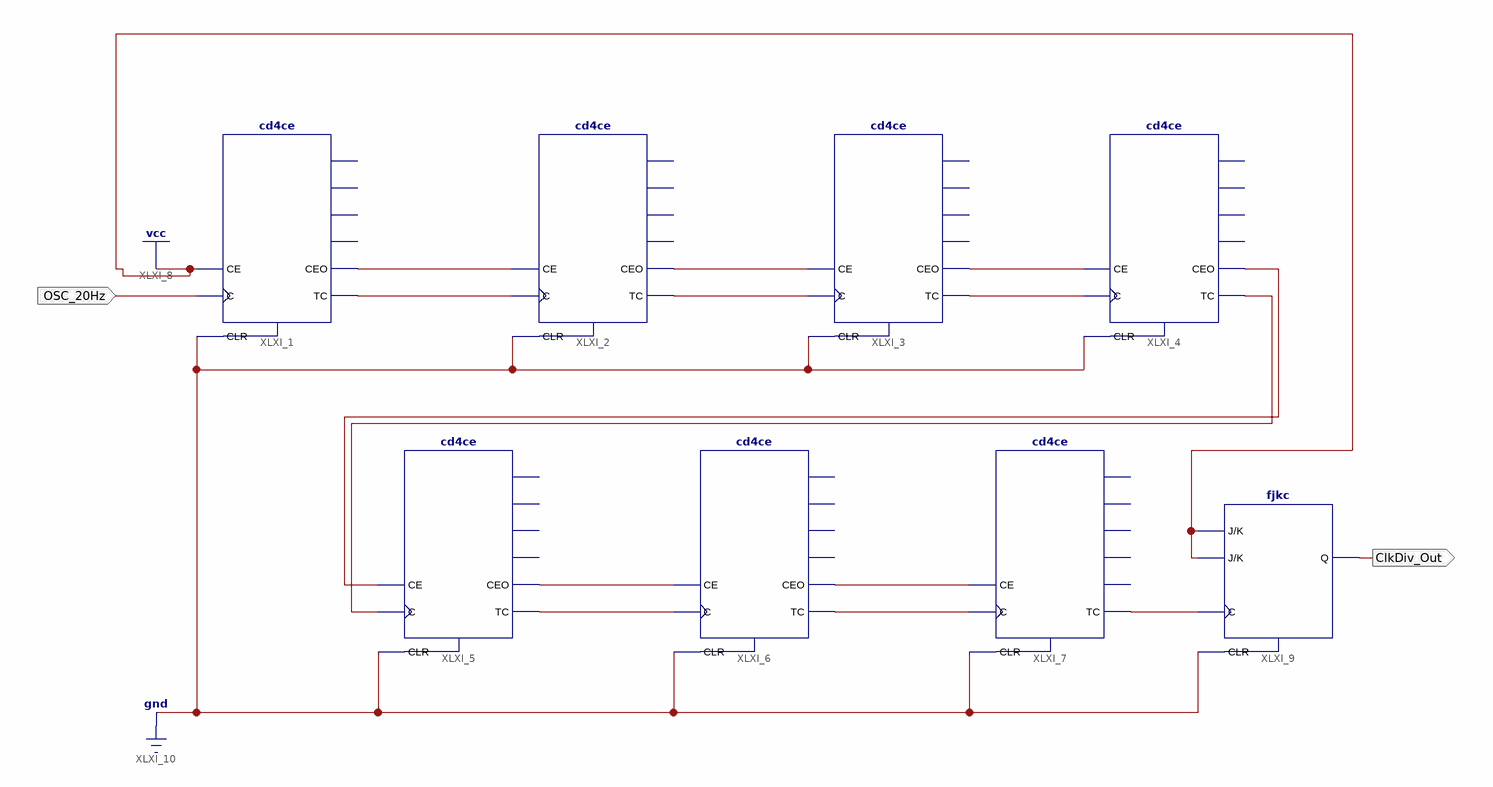
[diagram p0: schematic sheet 1]
// Xilinx ISE schematic ToOneHz_DIVIDER.sch (spartan6) as structural Verilog: 8 symbols, 2 ports
module ToOneHz_DIVIDER (
  input  OSC_20Hz,
  output ClkDiv_Out
);

  wire XLXN_2, XLXN_3, XLXN_4, XLXN_5, XLXN_6, XLXN_7, XLXN_8, XLXN_9, XLXN_10, XLXN_11, XLXN_12, XLXN_13,
       XLXN_16;

  cd4ce XLXI_1 (.C(OSC_20Hz), .CE(1'b1), .CLR(1'b0), .CEO(XLXN_2), .TC(XLXN_8));  // open: Q0, Q1, Q2, Q3
  cd4ce XLXI_2 (.C(XLXN_8), .CE(XLXN_2), .CLR(1'b0), .CEO(XLXN_3), .TC(XLXN_9));  // open: Q0, Q1, Q2, Q3
  cd4ce XLXI_3 (.C(XLXN_9), .CE(XLXN_3), .CLR(1'b0), .CEO(XLXN_4), .TC(XLXN_10));  // open: Q0, Q1, Q2, Q3
  cd4ce XLXI_4 (.C(XLXN_10), .CE(XLXN_4), .CLR(1'b0), .CEO(XLXN_5), .TC(XLXN_11));  // open: Q0, Q1, Q2, Q3
  cd4ce XLXI_5 (.C(XLXN_11), .CE(XLXN_5), .CLR(1'b0), .CEO(XLXN_6), .TC(XLXN_12));  // open: Q0, Q1, Q2, Q3
  cd4ce XLXI_6 (.C(XLXN_12), .CE(XLXN_6), .CLR(1'b0), .CEO(XLXN_7), .TC(XLXN_13));  // open: Q0, Q1, Q2, Q3
  cd4ce XLXI_7 (.C(XLXN_13), .CE(XLXN_7), .CLR(1'b0), .TC(XLXN_16));  // open: CEO, Q0, Q1, Q2, Q3
  fjkc XLXI_9 (.C(XLXN_16), .CLR(1'b0), .J(1'b1), .K(1'b1), .Q(ClkDiv_Out));
endmodule
